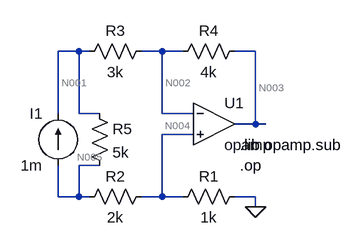
[diagram p0: schematic pag7es11p2.asc]
pag7es11p2.asc, the LTspice schematic file:
Version 4
SHEET 1 880 680
WIRE 48 16 16 16
WIRE 64 16 48 16
WIRE 176 16 144 16
WIRE 208 16 176 16
WIRE 320 16 288 16
WIRE 16 112 16 16
WIRE 48 112 48 16
WIRE 80 112 48 112
WIRE 176 112 176 16
WIRE 224 112 176 112
WIRE 320 128 320 16
WIRE 320 128 288 128
WIRE 336 128 320 128
WIRE 224 144 176 144
WIRE 80 192 48 192
WIRE 16 240 16 192
WIRE 48 240 48 192
WIRE 48 240 16 240
WIRE 64 240 48 240
WIRE 176 240 176 144
WIRE 176 240 144 240
WIRE 208 240 176 240
WIRE 320 240 288 240
WIRE 320 256 320 240
FLAG 320 256 0
SYMBOL current 16 192 R180
WINDOW 0 24 80 Left 2
WINDOW 3 24 0 Left 2
SYMATTR InstName I1
SYMATTR Value 1m
SYMBOL res 160 224 R90
WINDOW 0 0 56 VBottom 2
WINDOW 3 32 56 VTop 2
SYMATTR InstName R2
SYMATTR Value 2k
SYMBOL res 304 224 R90
WINDOW 0 0 56 VBottom 2
WINDOW 3 32 56 VTop 2
SYMATTR InstName R1
SYMATTR Value 1k
SYMBOL OpAmps\\opamp 256 64 R0
SYMATTR InstName U1
SYMBOL res 160 0 R90
WINDOW 0 0 56 VBottom 2
WINDOW 3 32 56 VTop 2
SYMATTR InstName R3
SYMATTR Value 3k
SYMBOL res 304 0 R90
WINDOW 0 0 56 VBottom 2
WINDOW 3 32 56 VTop 2
SYMATTR InstName R4
SYMATTR Value 4k
SYMBOL res 64 96 R0
SYMATTR InstName R5
SYMATTR Value 5k
TEXT 296 160 Left 2 !.lib opamp.sub
TEXT 296 192 Left 2 !.op

The netlist it stands for:
* pag7es11p2.asc
I1 N005 N001 1m
R2 N004 N005 2k
R1 0 N004 1k
XU1 N002 N004 N003 opamp Aol=100K GBW=10Meg  ; pins invin noninvin out
R3 N002 N001 3k
R4 N003 N002 4k
R5 N001 N005 5k
.lib opamp.sub
.op
.backanno
.end

* Results of the author's LTspice run, read from the files saved beside the schematic
* Operating Point:
*   V(n005) = -1.5 V
*   V(n001) = 1 V
*   V(n004) = -500 mV
*   V(n003) = -2.5 V
*   V(n002) = -500 mV
*   I(I1) = 1 mA
*   I(R5) = 500 µA
*   I(R4) = -500 µA
*   I(R3) = -500 µA
*   I(R1) = 500 µA
*   I(R2) = 500 µA
*   Ix(u1:3) = 500 µA